# EAGLE design BQ25606 (EAGLE 9.3.0)
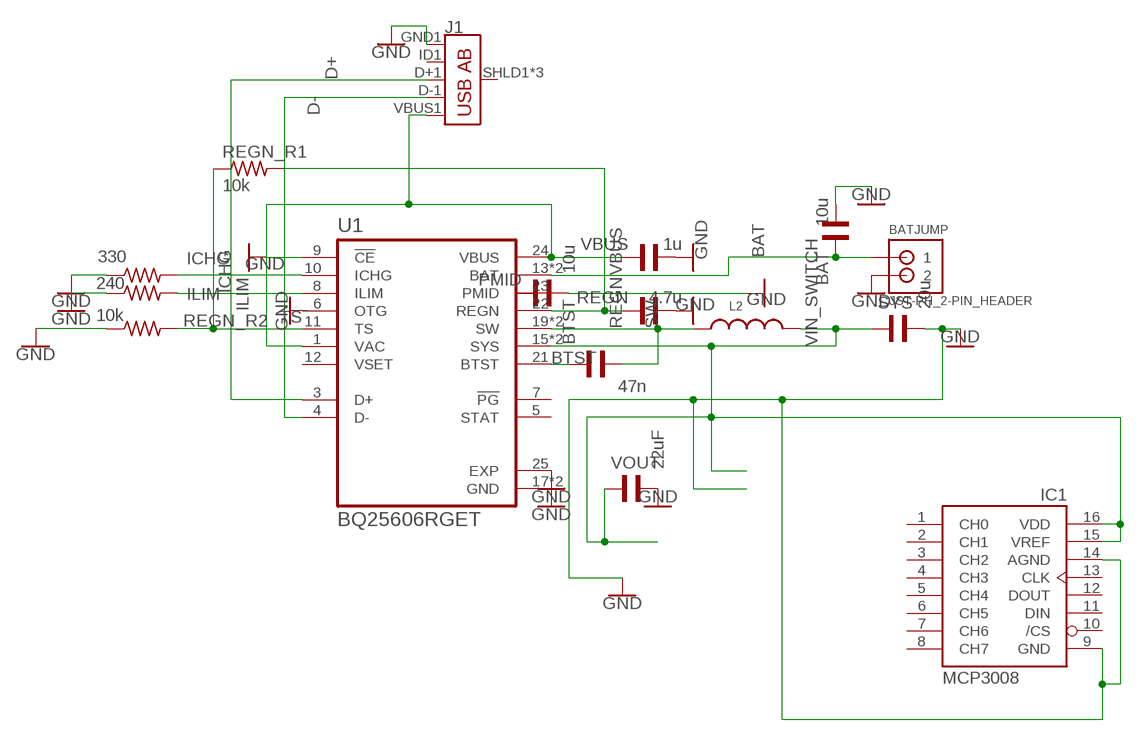
[diagram p0: schematic, sheet 1]

## Parts
BAT  10u  WCAP-CSMH_0805_885342007004_REFLOW  [WCAP-CSMH_0805_REFLOW]
BATJUMP  JST-PH_2-PIN_HEADER  [JST_B2B-PH_HEADER]
BTST  47n  WCAP-CSGP_0805_885012006082_WAVE  [WCAP-CSGP_0805_WAVE]
IC1  MCP3008  [DIL16]
ICHG  330  R-US_M0805  [M0805]
ILIM  240  R-US_M0805  [M0805]
J1  USB_AB_SMT  [USB-AB-MICRO-SMD]
L2  WE-PMI_0805_74479775215  [WE-PMI_0805]
PMID  10u  WCAP-CSMH_0805_885342007004_REFLOW  [WCAP-CSMH_0805_REFLOW]
REGN  4.7u  WCAP-CSGP_0805_885012006082_WAVE  [WCAP-CSGP_0805_WAVE]
REGN_R1  10k  R-US_M0805  [M0805]
REGN_R2  10k  R-US_M0805  [M0805]
SYS  20u  WCAP-CSMH_0805_885342007004_REFLOW  [WCAP-CSMH_0805_REFLOW]
U1  BQ25606RGET  [QFN50P400X400X100-25N270X270]
VBUS  1u  WCAP-CSMH_0805_885342007004_REFLOW  [WCAP-CSMH_0805_REFLOW]
VOUT  22uF  WCAP-CSMH_0805_885342007004_REFLOW  [WCAP-CSMH_0805_REFLOW]

## Nets
BAT: BAT.2 BATJUMP.P1 U1.13(BAT) U1.14(BAT)
BTST: BTST.2 U1.21(BTST)
D+: J1.D+1(D+) U1.3(D+)
D-: J1.D-1(D-) U1.4(D-)
GND: BAT.1 BATJUMP.P2 IC1.9(GND) IC1.14(AGND) ICHG.1 ILIM.1 J1.GND1(GND) PMID.1 REGN.1 REGN_R2.1 SYS.1 U1.6(OTG) U1.9(!CE) U1.17(GND) U1.18(GND) U1.25(EXP) VBUS.1 VOUT.1
ICHG: ICHG.2 U1.10(ICHG)
ILIM: ILIM.2 U1.8(ILIM)
REGN: REGN.2 REGN_R1.2 U1.22(REGN)
SW: BTST.1 L2.1 U1.19(SW) U1.20(SW)
TS: REGN_R1.1 REGN_R2.2 U1.11(TS)
VBUS: J1.VBUS1(VBUS) U1.1(VAC) U1.24(VBUS) VBUS.2
VIN_SWITCH: IC1.15(VREF) IC1.16(VDD) L2.2 SYS.2 U1.15(SYS) U1.16(SYS) VOUT.2
Unconnected: IC1.1(CH0) IC1.2(CH1) IC1.3(CH2) IC1.4(CH3) IC1.5(CH4) IC1.6(CH5) IC1.7(CH6) IC1.8(CH7) IC1.10(/CS) IC1.11(DIN) IC1.12(DOUT) IC1.13(CLK) J1.ID1(USBID) J1.SHLD1(SHIELD) J1.SHLD2(SHIELD) J1.SHLD3(SHIELD) PMID.2 U1.5(STAT) U1.7(!PG) U1.12(VSET)

## Power pins joined to a net without a drawn wire
PMID: U1.23(PMID)

## Library data of the parts
BAT = Wurth_Elektronik_Passive_Capacitors_rev18b:WCAP-CSMH_0805: WCAP-CSMH Ceramic Capacitors Characteristics MLCC - Multilayer Ceramic Chip Capacitor Recommended soldering: Reflow Wave Soldering only recommended for parts in 0603, 0805, 1206 with a thickness < 1 mm Operating temperature range: –55 °C to +125 °C Available Ceramic Types: Class 1 – NP0 / Class 2 – X7R Applications DC-DC converters Surge and Burst requirements i.e. in I/O applications and ports DC blocking/ High Voltage coupling Snubbers for high frequency converters <http://katalog.we-online.de/media/images/v2/Family_WCAP-CSMH.jpg> Details see: http://katalog.we-online.de/en/pbs/WCAP-CSMH? Created By Yingchun,Shan 2017-07-19 2017 (C) Wurth Elektronik; MPN: GRM21BR61E106KA73L; OC_NEWARK: 18X9675; WE-NUMBER: 885342007004/15pF
BATJUMP = SRG:JST-PH_2-PIN_HEADER: 2-pin JST PH Shrouded Header, top entry P/N B2B-PH-K-S Mating connector PHR-2 Mating cable assembly: Sparkfun PRT-09914 <http://www.sparkfun.com/products/9914>; OC_NEWARK: unknown
BTST = Wurth_Elektronik_Passive_Capacitors_rev18b:WCAP-CSGP_0805: WCAP-CSGP Ceramic Capacitors Characteristics Multilayer Ceramic Chip Capacitor Recommended soldering:Reflow, for 0603 and 0805 wave soldering is also allowed Operating temperature:-55 °C to +125 °C; Ceramic characteristics: Class I - NPO ; Class II -X7R, X5R High performance ceramic High capacitance stability Minimal aging Termination:Cu/Ni/Sn <http://katalog.we-online.de/media/images/eisos/WCAP-CSGP_pf2.jpg> Details see: http://katalog.we-online.de/en/pbs/WCAP-CSGP-0805? Created: 2015-01-28 2015 (C) Wurth Elektronik; MPN: MC0805B473K500CT; OC_NEWARK: 06R3872
IC1 = adafruit:MCP3008
ICHG = rcl:R-US_: RESISTOR, American symbol; MF: OUTSOURCE ITEM; MPN: RR1220P-331-D; OC_NEWARK: 28K1140; SPICEPREFIX: R
ILIM = rcl:R-US_: RESISTOR, American symbol; OC_NEWARK: unknown; SPICEPREFIX: R
J1 = SparkFun-Connectors:USB_AB: USB Type AB Micro Connector OTG-compatible. 5 pins, 3 shield pins SparkFun Products: IOIO-OTG <https://www.sparkfun.com/products/13613> SparkFun SAMD21 Mini Breakout <https://www.sparkfun.com/products/13664>; PROD_ID: CONN-11794
L2 = Wurth_Elektronik_Passive_rev18f:WE-PMI_0805: Power Multilayer Inductor Characteristics Compact multilayer type Suitable for applications with high currents up to 2.7 A Smallest RDC-Values starting at 40 mΩ Magnetically shielded construction: No crosstalk Operating temperature: –40 °C to +125 °C Available in four sizes and three different types (Low Profile, Low RDC & High Saturation Current) Recommended soldering profile: Reflow Applications DC/DC converters especially at high switching frequencies > 1 MHz Electronic devices with very low profile Portable devices like Smart Phones, Tablets, Notebooks and Digital Cameras <http://katalog.we-online.de/media/images/v2/Family_WE-PMI.jpg> Details see: http://katalog.we-online.de/en/pbs/WE-PMI? Updated by Dan Xu 2014-07-08 2014 (C) Wurth Elektronik; WE-NUMBER: 74479775215/1,5uH
PMID = Wurth_Elektronik_Passive_Capacitors_rev18b:WCAP-CSMH_0805: WCAP-CSMH Ceramic Capacitors Characteristics MLCC - Multilayer Ceramic Chip Capacitor Recommended soldering: Reflow Wave Soldering only recommended for parts in 0603, 0805, 1206 with a thickness < 1 mm Operating temperature range: –55 °C to +125 °C Available Ceramic Types: Class 1 – NP0 / Class 2 – X7R Applications DC-DC converters Surge and Burst requirements i.e. in I/O applications and ports DC blocking/ High Voltage coupling Snubbers for high frequency converters <http://katalog.we-online.de/media/images/v2/Family_WCAP-CSMH.jpg> Details see: http://katalog.we-online.de/en/pbs/WCAP-CSMH? Created By Yingchun,Shan 2017-07-19 2017 (C) Wurth Elektronik; MPN: C2012X5R1A226M125AB; OC_NEWARK: 04X3271; WE-NUMBER: 885342007004/15pF
REGN = Wurth_Elektronik_Passive_Capacitors_rev18b:WCAP-CSGP_0805: WCAP-CSGP Ceramic Capacitors Characteristics Multilayer Ceramic Chip Capacitor Recommended soldering:Reflow, for 0603 and 0805 wave soldering is also allowed Operating temperature:-55 °C to +125 °C; Ceramic characteristics: Class I - NPO ; Class II -X7R, X5R High performance ceramic High capacitance stability Minimal aging Termination:Cu/Ni/Sn <http://katalog.we-online.de/media/images/eisos/WCAP-CSGP_pf2.jpg> Details see: http://katalog.we-online.de/en/pbs/WCAP-CSGP-0805? Created: 2015-01-28 2015 (C) Wurth Elektronik; MPN: C2012X5R1H475K125AB; OC_NEWARK: 12T1918
REGN_R1 REGN_R2 = rcl:R-US_: RESISTOR, American symbol; MPN: ERJ-6ENF1002V; OC_NEWARK: 64R5370; SPICEPREFIX: R
SYS VOUT = Wurth_Elektronik_Passive_Capacitors_rev18b:WCAP-CSMH_0805: WCAP-CSMH Ceramic Capacitors Characteristics MLCC - Multilayer Ceramic Chip Capacitor Recommended soldering: Reflow Wave Soldering only recommended for parts in 0603, 0805, 1206 with a thickness < 1 mm Operating temperature range: –55 °C to +125 °C Available Ceramic Types: Class 1 – NP0 / Class 2 – X7R Applications DC-DC converters Surge and Burst requirements i.e. in I/O applications and ports DC blocking/ High Voltage coupling Snubbers for high frequency converters <http://katalog.we-online.de/media/images/v2/Family_WCAP-CSMH.jpg> Details see: http://katalog.we-online.de/en/pbs/WCAP-CSMH? Created By Yingchun,Shan 2017-07-19 2017 (C) Wurth Elektronik; MPN: CC0402KRX5R6BB105; OC_NEWARK: 68R4631; WE-NUMBER: 885342007004/15pF
U1 = BQ25606RGET:BQ25606RGET: Stand Alone Single Cell 3-A Fast Charger with High Input Voltage and Power Path 24-VQFN -40 to 85; AVAILABILITY: Unavailable; DESCRIPTION: Stand Alone Single Cell 3-A Fast Charger with High Input Voltage and Power Path 24-VQFN -40 to 85; MF: Texas Instruments; MP: BQ25606RGET; MPN: BQ25606RGET .; OC_NEWARK: 23AC2903; PACKAGE: VQFN-24 Texas Instruments; PRICE: None
VBUS = Wurth_Elektronik_Passive_Capacitors_rev18b:WCAP-CSMH_0805: WCAP-CSMH Ceramic Capacitors Characteristics MLCC - Multilayer Ceramic Chip Capacitor Recommended soldering: Reflow Wave Soldering only recommended for parts in 0603, 0805, 1206 with a thickness < 1 mm Operating temperature range: –55 °C to +125 °C Available Ceramic Types: Class 1 – NP0 / Class 2 – X7R Applications DC-DC converters Surge and Burst requirements i.e. in I/O applications and ports DC blocking/ High Voltage coupling Snubbers for high frequency converters <http://katalog.we-online.de/media/images/v2/Family_WCAP-CSMH.jpg> Details see: http://katalog.we-online.de/en/pbs/WCAP-CSMH? Created By Yingchun,Shan 2017-07-19 2017 (C) Wurth Elektronik; MPN: MCTT21X105K160CT; OC_NEWARK: 06R3671; WE-NUMBER: 885342007004/15pF

## Net classes
0 default: width 0.305 mm, drill 0.3 mm, clearance 0.2 mm

## Board
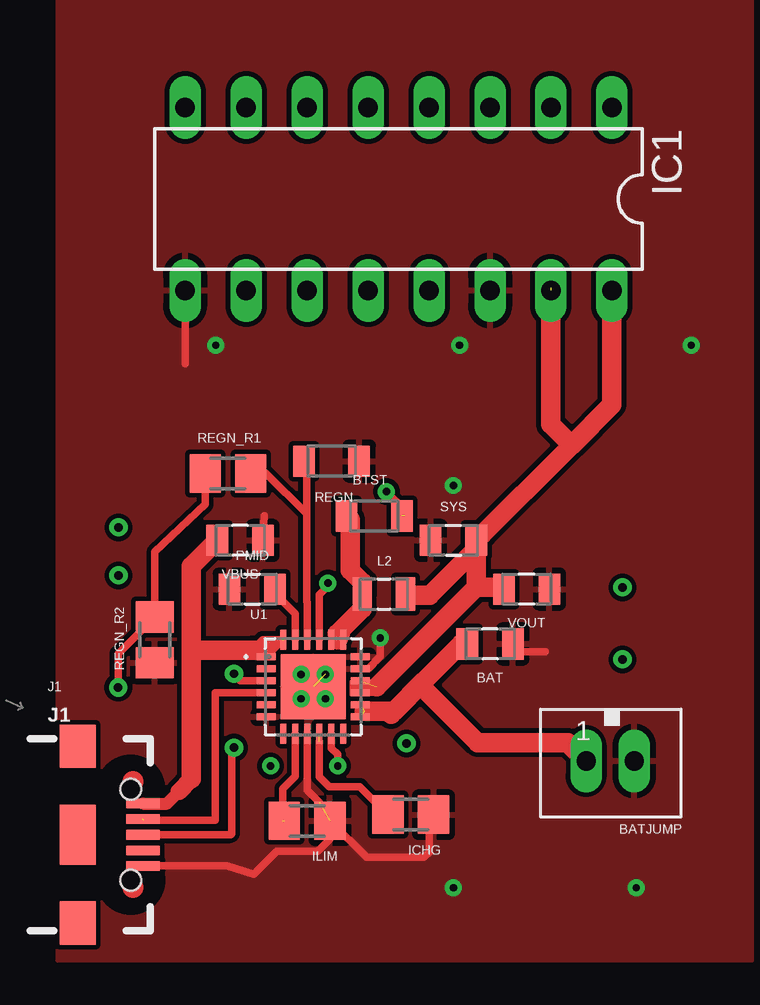
[diagram p1: board, top side]
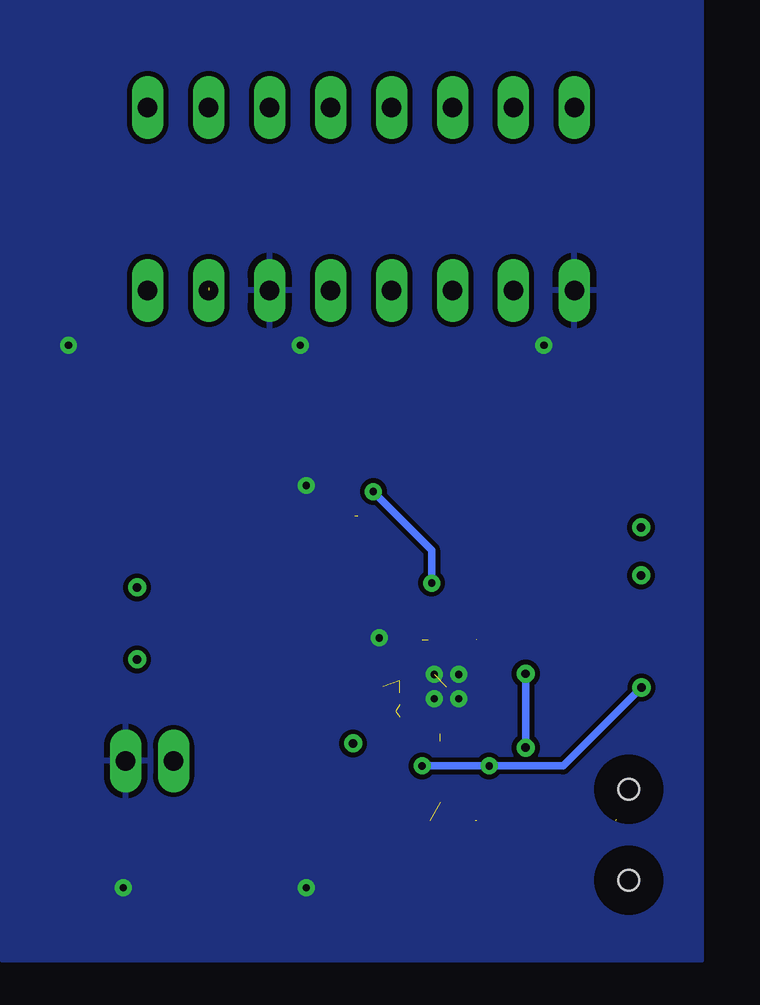
[diagram p2: board, bottom side, seen from below]

No outline drawn. Coordinates in mm, seen from the top.
Copper layers (1*16): Top 0.035mm / dielectric 1.5mm / Bottom 0.035mm
Design rules "default *": minimum track width 6mil, minimum drill 0.35mm, track to track 6mil, track to pad 6mil, pad to pad 6mil, via to via 6mil, smd to smd 6mil, copper to edge 40mil, drill to drill 6mil, minimum pad ring 10mil, minimum via ring 8mil, stop-mask expansion 4mil, vias tented up to drill 13mil, thermal gap 10mil

### Footprints (pad centres in the part's own frame; a part is rotated, then mirrored left to right if it is on the bottom)
WCAP-CSMH_0805_REFLOW = smd 0.9 x 1.3: 1 -0.95,0; 2 0.95,0
JST_B2B-PH_HEADER = drill 0.8 long: P1 1.075,0.048; P2 -0.925,0.048
WCAP-CSGP_0805_WAVE = smd 0.9 x 1.3: 1 -1.15,0; 2 1.15,0
DIL16 = drill 0.813 long: 1 -8.89,-3.81; 2 -6.35,-3.81; 3 -3.81,-3.81; 4 -1.27,-3.81; 5 1.27,-3.81; 6 3.81,-3.81; 7 6.35,-3.81; 8 8.89,-3.81; 9 8.89,3.81; 10 6.35,3.81; 11 3.81,3.81; 12 1.27,3.81; 13 -1.27,3.81; 14 -3.81,3.81; 15 -6.35,3.81; 16 -8.89,3.81
M0805 = smd 1.3 x 1.6: 1 -0.95,0; 2 0.95,0
USB-AB-MICRO-SMD = smd 1.4 x 0.4: D+1 2.7,0; D-1 2.7,0.65; GND1 2.7,-1.3; ID1 2.7,-0.65; VBUS1 2.7,1.3 | smd 1.5 x 1.8: SHLD1 0,-3.68; SHLD2 0,3.68 | smd 1.5 x 2.5: SHLD3 0,0 | hole 0.85: 2.2,1.9; 2.2,-1.9
WE-PMI_0805 = smd 0.8 x 1.4: 1 -0.9,0; 2 0.9,0
QFN50P400X400X100-25N270X270 = smd 0.81 x 0.26: 1 -1.955,1.25; 2 -1.955,0.75; 3 -1.955,0.25; 4 -1.955,-0.25; 5 -1.955,-0.75; 6 -1.955,-1.25; 13 1.955,-1.25; 14 1.955,-0.75; 15 1.955,-0.25; 16 1.955,0.25; 17 1.955,0.75; 18 1.955,1.25 | smd 0.26 x 0.81: 7 -1.25,-1.955; 8 -0.75,-1.955; 9 -0.25,-1.955; 10 0.25,-1.955; 11 0.75,-1.955; 12 1.25,-1.955; 19 1.25,1.955; 20 0.75,1.955; 21 0.25,1.955; 22 -0.25,1.955; 23 -0.75,1.955; 24 -1.25,1.955 | smd 2.7 x 2.7: 25 0,0

### Placement (x,y rotation side)
BAT  14.48,-6.86 180 top
BATJUMP  19.56,-11.68 180 top
BTST  9.65,-1.52 0 top
IC1  10.67,11.68 180 top
ICHG  11.18,-13.97 180 top
ILIM  6.86,-14.22 180 top
J1  -2.69,-14.8 0 top
L2  10.06,-4.78 0 top
PMID  4.57,-4.57 0 top
REGN  7.87,0.76 180 top
REGN_R1  3.56,0.25 0 top
REGN_R2  0.51,-6.68 90 top
SYS  12.95,-2.54 0 top
U1  7.11,-8.64 0 top
VBUS  4.06,-2.54 180 top
VOUT  16,-4.57 180 top

### Tracks (layer width: path | path; a pad name or v marks a point on that pad's centre or on a via)
BAT  (2 unrouted)
  Top 0.305: 11.72,-8.72 11.72,-8.42
  Top 0.813: BAT.2 13.28,-6.86 11.72,-8.42 10.48,-9.66 | 10.48,-9.66 10.36,-9.79 | BATJUMP.P1 17.72,-10.97 13.97,-10.97 11.72,-8.72 | 10.48,-9.66 9.23,-9.66
BTST  (via drill 0.3)  (1 unrouted)
  Top 0.305: v10.16,-0.51 10.92,-1.27 10.92,-1.52 | v7.73,-4.32 7.73,-4.44 7.36,-4.81 U1.21
  Bottom 0.305: v10.16,-0.51 7.73,-2.94 v7.73,-4.32
D+  (via drill 0.35)
  Top 0.305: U1.3 4.06,-8.38 4.06,-8.35 v3.81,-8.1 | v3.81,-11.18 3.71,-11.28 3.71,-14.76 3.66,-14.8 J1.D+1
  Bottom 0.305: v3.81,-8.1 v3.81,-11.18
D-  (1 unrouted)
  Top 0.305: U1.4 3.03,-8.89 3.03,-14.2 0.06,-14.2
GND  (via drill 0.3)  (2 unrouted)
  Top 0.305: U1.17 9.4,-7.89 9.91,-7.38 v9.91,-6.6 | U1.9 6.86,-12.96 7.37,-13.46 | 11.94,-14.48 11.94,-15.53 11.72,-15.75 9.33,-15.75 ILIM.1 7.81,-14.99 7.3,-15.49 5.59,-15.49 4.64,-16.45 3.51,-16.1 J1.GND1 | BAT.1 15.45,-6.86 15.77,-7.18 16.79,-7.18 | VBUS.1 5.08,-1.52 | IC1.9 1.78,4.83
  other vias: 3.05,5.59 22.86,5.59 13.21,5.59 12.95,-17.02 20.57,-17.02 12.95,-0.25 7.62,-9.14 7.62,-8.13 6.6,-8.13 6.6,-9.14
  pour Top: -3.56,21.84 25.4,21.84 25.4,-20.07 -3.56,-20.07
  pour Bottom: -3.56,21.84 25.65,21.84 25.65,-20.06 -3.56,-20.06
ICHG  (1 unrouted)
  Top 0.305: 7.37,-10.91 7.37,-12.4 7.77,-12.8 9.06,-12.8 ICHG.2
ILIM  (1 unrouted)
  Top 0.305: U1.8 6.36,-12.37 5.84,-12.89 5.84,-14.22 | ILIM.2 5.91,-13.65
N$1  (via drill 0.35)
  other vias: -1,-2
N$2  (via drill 0.35)
  other vias: 20,-4.5
N$3  (via drill 0.35)
  other vias: 20,-7.5
N$4  (via drill 0.35)
  other vias: 11,-11
N$5  (via drill 0.35)
  other vias: -1,-4
PMID
  Top 0.305: 6.36,-6.11 U1.23 6.36,-5.6 5.84,-5.08
REGN
  Top 0.305: 6.83,-1.44 5.14,0.25 REGN_R1.2 | 6.86,-5.11 arc-90 6.83,-5.08 | 6.86,-5.11 U1.22 | REGN.2 6.83,0.76 6.83,-1.44 | 6.86,-5.11 6.83,-5.08 | 6.83,-5.08 6.83,-1.44
SW  (1 unrouted)
  Top 0.305: 8.25,-6.68 U1.19 8.13,-6.68 | 8.23,-6.43 8.12,-6.43 | BTST.1 8.66,-1.68 | 9.16,-5.38 L2.1
  Top 0.813: 8.13,-6.68 8.23,-6.43 | 8.66,-1.68 8.66,-3.78 9.16,-4.28 L2.1 | 8.12,-6.43 9.16,-5.38
TS  (via drill 0.3, 0.35)
  Top 0.305: REGN_R1.1 2.61,-1.04 0.51,-3.02 REGN_R2.2 -1.02,-7.26 v-1.02,-8.67 | v8.13,-11.94 8.13,-11.46 7.86,-11.2 U1.11
  Bottom 0.305: v8.13,-11.94 v5.33,-11.94 2.25,-11.94 v-1.02,-8.67
VBUS  (1 unrouted)
  Top 0.305: U1.1 5.16,-7.11 5.41,-7.11 5.84,-6.68 5,-6.68 4.57,-7.11
  Top 0.5: J1.VBUS1 1.01,-13.5 1.51,-13
  Top 0.7: 1.51,-13 2.03,-12.48
  Top 0.813: VBUS.2 2.03,-3.62 2.03,-7.11 | 2.03,-7.11 4.57,-7.11 5.16,-7.11 | 2.03,-7.11 2.03,-12.48
VIN_SWITCH  (3 unrouted)
  Top 0.305: 14.8,-4.32 VOUT.2 14.97,-4.5 | 17.01,7.99 17.02,7.98 | L2.2 11,-4.82
  Top 0.813: SYS.2 13.9,-2.89 11.98,-4.82 11,-4.82 | SYS.2 13.9,-4.5 | SYS.2 14.16,-2.29 | IC1.16 19.56,3.11 17.87,1.43 | 17.87,1.43 SYS.2 | 13.9,-4.5 9.77,-8.63 | 13.9,-4.5 14.97,-4.5 | 17.87,1.43 17.01,2.3 17.01,7.99
(copper drawn outside any net)
  shapes: Top area x1, Top circle x2